# Altium project Nimb_ver_2_0.PrjPcb
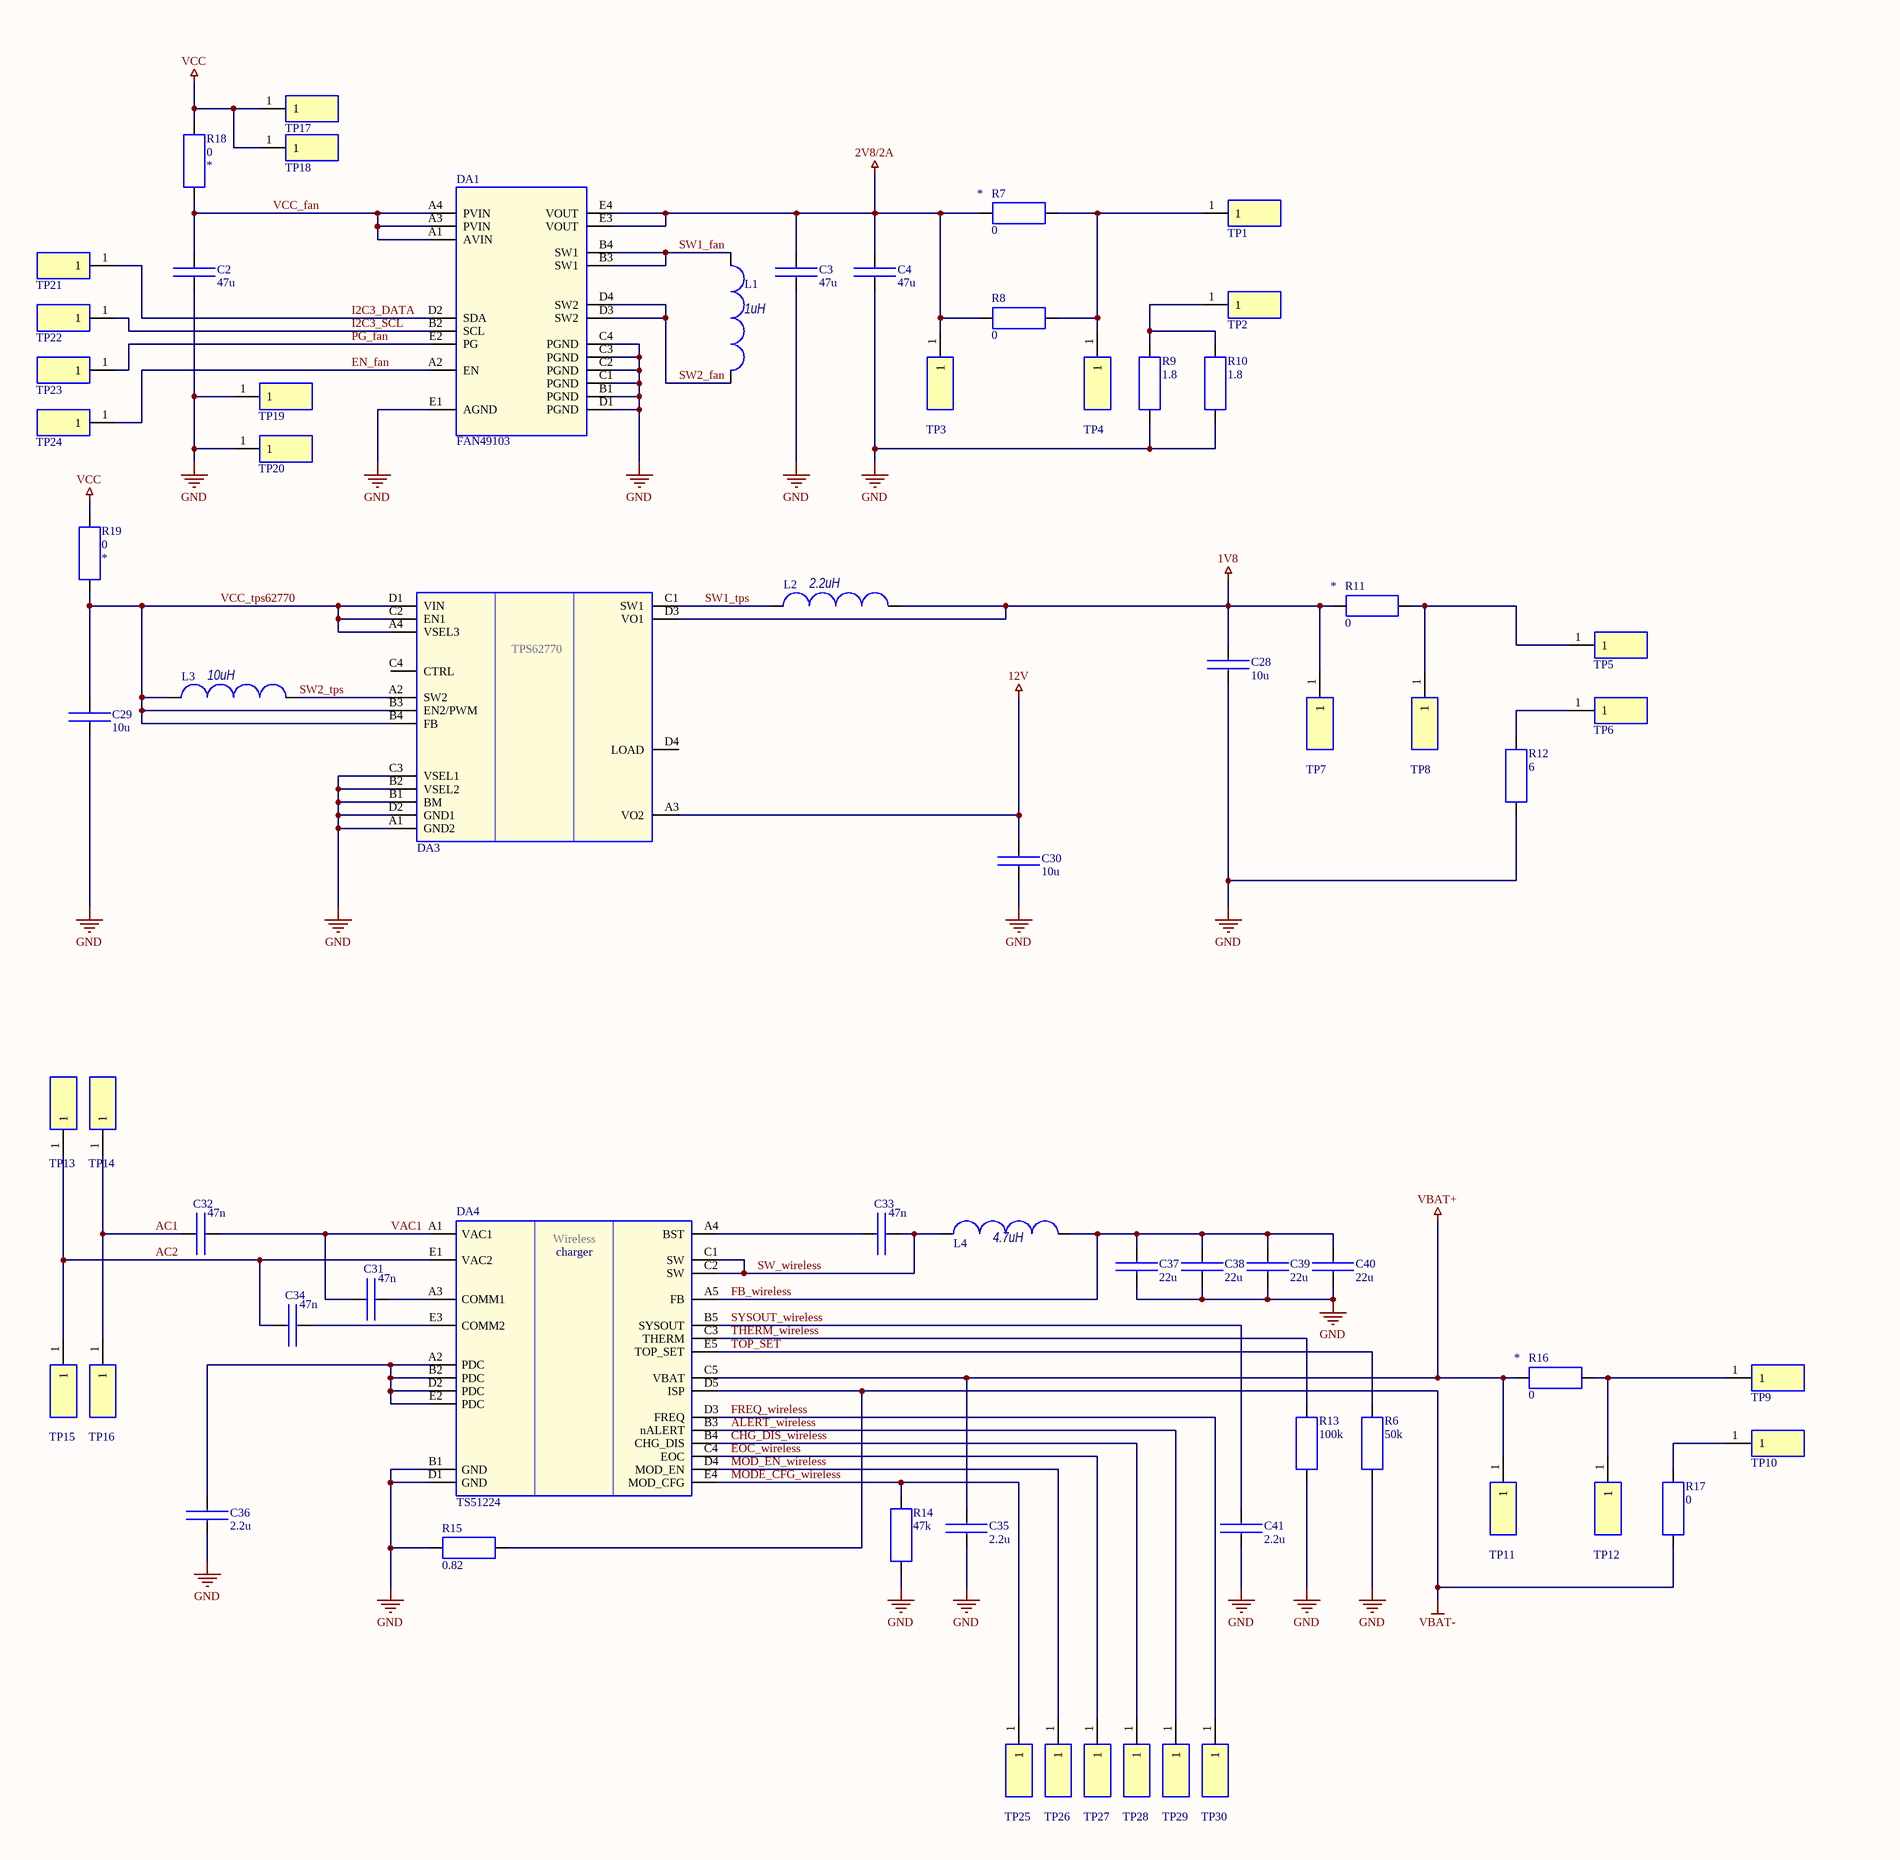
[diagram p0: Nimb_Ring_2_0.SchDoc, left]
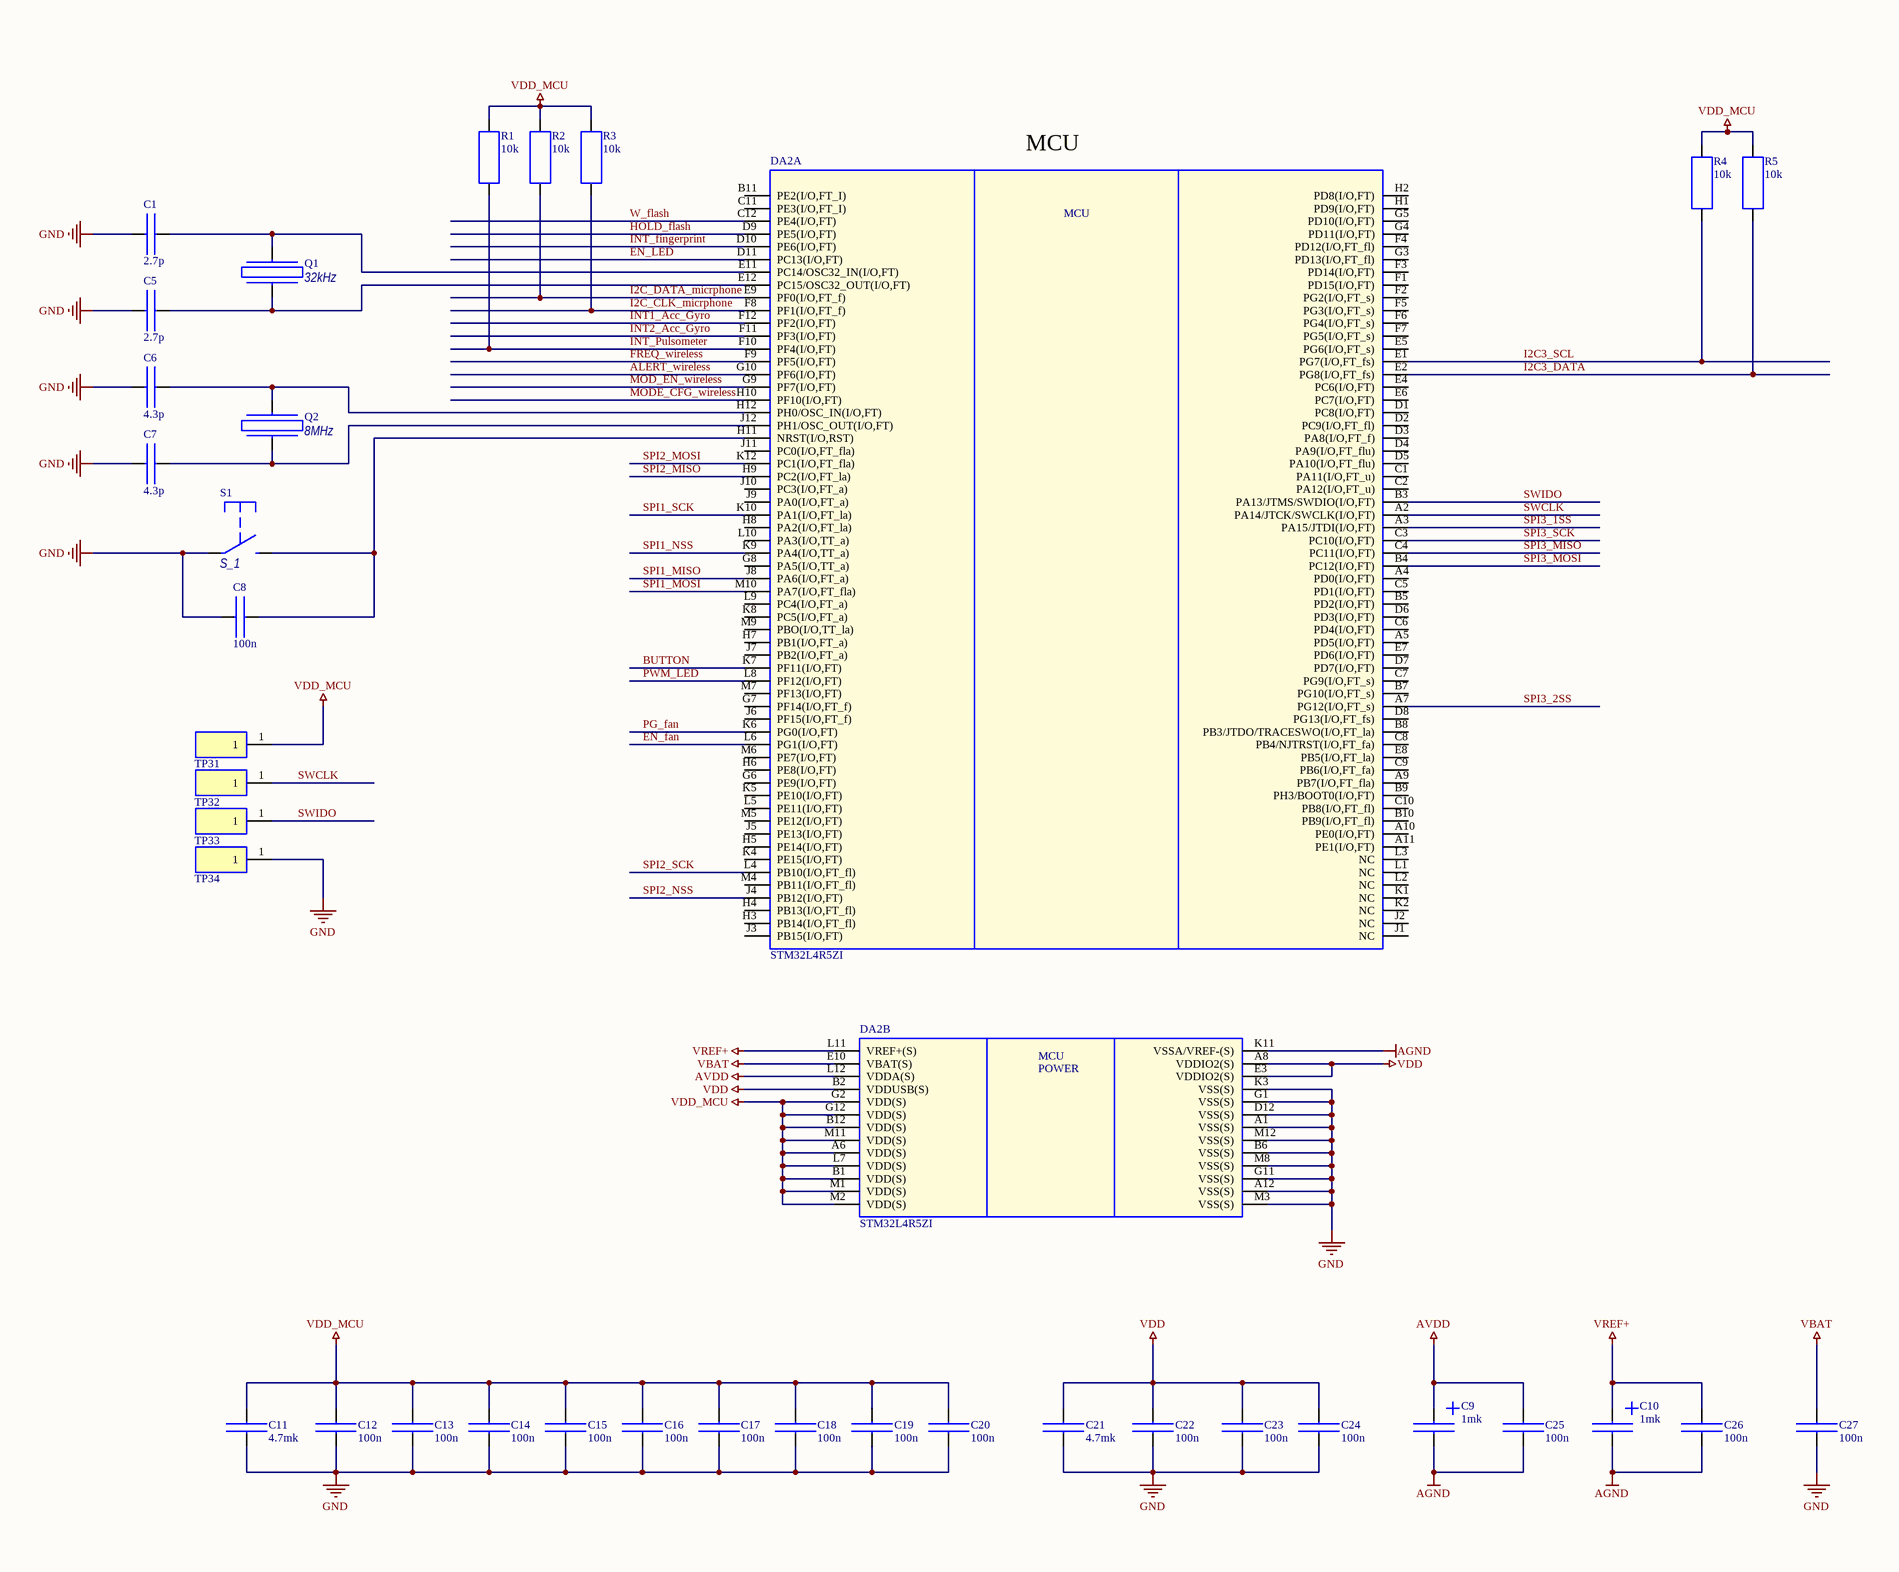
[diagram p1: Nimb_Ring_2_0.SchDoc, right]
1 sheet, 105 parts. Net scope: global (net labels, ports and power ports of the same name join across sheets).
Board file: Nimb_Ring_2_0.PcbDoc

## Sheet Nimb_Ring_2_0.SchDoc
size A1

### Parts
C1  2.7p  [CAP_0201]
C2  47u  [Cap0603]
C3  47u  [Cap0603]
C4  47u  [Cap0603]
C5  2.7p  [CAP_0201]
C6  4.3p  [CAP_0201]
C7  4.3p  [CAP_0201]
C8  100n  [CAP_0201]
C9  1mk  [CAP_0201]
C10  1mk  [CAP_0201]
C11  4.7mk  [CAP_0201]
C12  100n  [CAP_0201]
C13  100n  [CAP_0201]
C14  100n  [CAP_0201]
C15  100n  [CAP_0201]
C16  100n  [CAP_0201]
C17  100n  [CAP_0201]
C18  100n  [CAP_0201]
C19  100n  [CAP_0201]
C20  100n  [CAP_0201]
C21  4.7mk  [CAP_0201]
C22  100n  [CAP_0201]
C23  100n  [CAP_0201]
C24  100n  [CAP_0201]
C25  100n  [CAP_0201]
C26  100n  [CAP_0201]
C27  100n  [CAP_0201]
C28  10u  [Cap0402]
C29  10u  [Cap0402]
C30  10u  [Cap0402]
C31  47n  [Cap0402]
C32  47n  [Cap0402]
C33  47n  [Cap0402]
C34  47n  [Cap0402]
C35  2.2u  [Cap0603]
C36  2.2u  [Cap0402]
C37  22u  [Cap0603]
C38  22u  [Cap0603]
C39  22u  [Cap0603]
C40  22u  [Cap0603]
C41  2.2u  [Cap0603]
DA1  FAN49103  [WLCSP20]
DA2  STM32L4R5ZI  [WLCSP144]  (parts A,B of 2)
DA3  TPS62770  [DSBGA16]  (value not drawn)
DA4  TS51224  [BGA_25 (5x5 ARRAY)]
L1  1uH  [Ind_0806]
L2  2.2uH  [IND_0806(2016metric)]
L3  10uH  [IND_0806(2016metric)]
L4  4.7uH  [COIL-1008CS_V]
Q1  32kHz  [NX3215SA-32.768KHZ-EXS00A-MU00525]
Q2  8MHz  [NDK-NX3225GD-8MHZ-STD-CRA-3_V]
R1  10k  [RESC0402(1005)_L]
R2  10k  [RESC0402(1005)_L]
R3  10k  [RESC0402(1005)_L]
R4  10k  [RESC0402(1005)_L]
R5  10k  [RESC0402(1005)_L]
R6  50k  [RESC0402(1005)_L]
R7  0  [RES2512(6332M)]
R8  0  [RES6.5-3.4X1.9]
R9  1.8  [RES2512(6332M)]
R10  1.8  [RES6.5-3.4X1.9]
R11  0  [RES2512(6332M)]
R12  6  [RES2512(6332M)]
R13  100k  [RESC0402(1005)_L]
R14  47k  [RESC0402(1005)_L]
R15  0.82  [RES0603(1608M)]
R16  0  [RES2512(6332M)]
R17  0  [RES2512(6332M)]
R18  0  [RES2512(6332M)]
R19  0  [RES2512(6332M)]
S1  S_1  [BOUR-7914G-1-000E_V]
TP1  Test_Pad  [TEST_PAD_Button]  (value not drawn)
TP2  Test_Pad  [TEST_PAD_Button]  (value not drawn)
TP3  Test_Pad  [Test_Pad_PLS1]  (value not drawn)
TP4  Test_Pad  [Test_Pad_PLS1]  (value not drawn)
TP5  Test_Pad  [TEST_PAD_Button]  (value not drawn)
TP6  Test_Pad  [TEST_PAD_Button]  (value not drawn)
TP7  Test_Pad  [Test_Pad_PLS1]  (value not drawn)
TP8  Test_Pad  [Test_Pad_PLS1]  (value not drawn)
TP9  Test_Pad  [TEST_PAD_Button]  (value not drawn)
TP10  Test_Pad  [TEST_PAD_Button]  (value not drawn)
TP11  Test_Pad  [Test_Pad_PLS1]  (value not drawn)
TP12  Test_Pad  [Test_Pad_PLS1]  (value not drawn)
TP13  Test_Pad  [Test_Pad_PLS1]  (value not drawn)
TP14  Test_Pad  [Test_Pad_PLS1]  (value not drawn)
TP15  Test_Pad  [TEST_PAD_Button]  (value not drawn)
TP16  Test_Pad  [TEST_PAD_Button]  (value not drawn)
TP17  Test_Pad  [TEST_PAD_Button]  (value not drawn)
TP18  Test_Pad  [Test_Pad_PLS1]  (value not drawn)
TP19  Test_Pad  [TEST_PAD_Button]  (value not drawn)
TP20  Test_Pad  [Test_Pad_PLS1]  (value not drawn)
TP21  Test_Pad  [Test_Pad_PLS1]  (value not drawn)
TP22  Test_Pad  [Test_Pad_PLS1]  (value not drawn)
TP23  Test_Pad  [Test_Pad_PLS1]  (value not drawn)
TP24  Test_Pad  [Test_Pad_PLS1]  (value not drawn)
TP25  Test_Pad  [Test_Pad_PLS1]  (value not drawn)
TP26  Test_Pad  [Test_Pad_PLS1]  (value not drawn)
TP27  Test_Pad  [Test_Pad_PLS1]  (value not drawn)
TP28  Test_Pad  [Test_Pad_PLS1]  (value not drawn)
TP29  Test_Pad  [Test_Pad_PLS1]  (value not drawn)
TP30  Test_Pad  [Test_Pad_PLS1]  (value not drawn)
TP31  Test_Pad  [Test_Pad_PLS1]  (value not drawn)
TP32  Test_Pad  [Test_Pad_PLS1]  (value not drawn)
TP33  Test_Pad  [Test_Pad_PLS1]  (value not drawn)
TP34  Test_Pad  [Test_Pad_PLS1]  (value not drawn)

### Nets
1V8: C28.2 DA3.D3(VO1) L2.2 R11.2 TP7.1
2V8/2A: C3.2 C4.2 DA1.E3(VOUT) DA1.E4(VOUT) R7.2 R8.2 TP3.1
12V: C30.2 DA3.A3(VO2)
AGND: C9.2 C10.2 C25.1 C26.1 DA2.K11(VSSA/VREF-(S))
AVDD: C9.1 C25.2 DA2.L12(VDDA(S))
GND: C1.2 C2.1 C3.1 C4.1 C5.2 C6.2 C7.2 C8.2 C11.1 C12.1 C13.1 C14.1 C15.1 C16.1 C17.1 C18.1 C19.1 C20.1 C21.1 C22.1 C23.1 C24.1 C27.1 C28.1 C29.1 C30.1 C35.2 C36.2 C37.2 C38.2 C39.2 C40.2 C41.2 DA1.B1(PGND) DA1.C1(PGND) DA1.C2(PGND) DA1.C3(PGND) DA1.C4(PGND) DA1.D1(PGND) DA1.E1(AGND) DA2.A1(VSS(S)) DA2.A12(VSS(S)) DA2.B6(VSS(S)) DA2.D12(VSS(S)) DA2.G1(VSS(S)) DA2.G11(VSS(S)) DA2.K3(VSS(S)) DA2.M3(VSS(S)) DA2.M8(VSS(S)) DA2.M12(VSS(S)) DA3.A1(GND2) DA3.B1(BM) DA3.B2(VSEL2) DA3.C3(VSEL1) DA3.D2(GND1) DA4.B1(GND) DA4.D1(GND) R6.1 R9.2 R10.2 R12.2 R13.1 R14.1 R15.2 S1.1 TP19.1 TP20.1 TP34.1
VBAT: C27.2 DA2.E10(VBAT(S))
VBAT+: C35.1 DA4.C5(VBAT) R16.2 TP11.1
VBAT-: DA4.D5(ISP) R15.1 R17.2
VCC: R18.1 R19.1 TP17.1 TP18.1
VDD: C21.2 C22.2 C23.2 C24.2 DA2.A8(VDDIO2(S)) DA2.B2(VDDUSB(S)) DA2.E3(VDDIO2(S))
VDD_MCU: C11.2 C12.2 C13.2 C14.2 C15.2 C16.2 C17.2 C18.2 C19.2 C20.2 DA2.A6(VDD(S)) DA2.B1(VDD(S)) DA2.B12(VDD(S)) DA2.G2(VDD(S)) DA2.G12(VDD(S)) DA2.L7(VDD(S)) DA2.M1(VDD(S)) DA2.M2(VDD(S)) DA2.M11(VDD(S)) R1.2 R2.2 R3.2 R4.2 R5.2 TP31.1
VREF+: C10.1 C26.2 DA2.L11(VREF+(S))
AC1: C32.1 TP14.1 TP16.1
AC2: C34.1 DA4.E1(VAC2) TP13.1 TP15.1
ALERT_wireless: DA2.G10(PF6(I/O,FT)) DA4.B3(nALERT) TP29.1
BUTTON: DA2.K7(PF11(I/O,FT))
CHG_DIS_wireless: DA4.B4(CHG_DIS) TP28.1
EN_fan: DA1.A2(EN) DA2.L6(PG1(I/O,FT)) TP24.1
EN_LED: DA2.D11(PC13(I/O,FT))
EOC_wireless: DA4.C4(EOC) TP27.1
FB_wireless: C37.1 C38.1 C39.1 C40.1 DA4.A5(FB) L4.2
FREQ_wireless: DA2.F9(PF5(I/O,FT)) DA4.D3(FREQ) TP30.1
HOLD_flash: DA2.D9(PE5(I/O,FT))
I2C3_DATA: DA1.D2(SDA) DA2.E2(PG8(I/O,FT_fs)) R5.1 TP21.1
I2C3_SCL: DA1.B2(SCL) DA2.E1(PG7(I/O,FT_fs)) R4.1 TP22.1
I2C_CLK_micrphone: DA2.F8(PF1(I/O,FT_f)) R3.1
I2C_DATA_micrphone: DA2.E9(PF0(I/O,FT_f)) R2.1
INT1_Acc_Gyro: DA2.F12(PF2(I/O,FT))
INT2_Acc_Gyro: DA2.F11(PF3(I/O,FT))
INT_fingerprint: DA2.D10(PE6(I/O,FT))
INT_Pulsometer: DA2.F10(PF4(I/O,FT)) R1.1
MOD_EN_wireless: DA2.G9(PF7(I/O,FT)) DA4.D4(MOD_EN) TP26.1
MODE_CFG_wireless: DA2.H10(PF10(I/O,FT)) DA4.E4(MOD_CFG) R14.2 TP25.1
PG_fan: DA1.E2(PG) DA2.K6(PG0(I/O,FT)) TP23.1
PWM_LED: DA2.L8(PF12(I/O,FT))
SPI1_MISO: DA2.J8(PA6(I/O,FT_a))
SPI1_MOSI: DA2.M10(PA7(I/O,FT_fla))
SPI1_NSS: DA2.K9(PA4(I/O,TT_a))
SPI1_SCK: DA2.K10(PA1(I/O,FT_la))
SPI2_MISO: DA2.H9(PC2(I/O,FT_la))
SPI2_MOSI: DA2.K12(PC1(I/O,FT_fla))
SPI2_NSS: DA2.J4(PB12(I/O,FT))
SPI2_SCK: DA2.L4(PB10(I/O,FT_fl))
SPI3_1SS: DA2.A3(PA15/JTDI(I/O,FT))
SPI3_2SS: DA2.A7(PG12(I/O,FT_s))
SPI3_MISO: DA2.C4(PC11(I/O,FT))
SPI3_MOSI: DA2.B4(PC12(I/O,FT))
SPI3_SCK: DA2.C3(PC10(I/O,FT))
SW1_fan: DA1.B3(SW1) DA1.B4(SW1) L1.1
SW1_tps: DA3.C1(SW1) L2.1
SW2_fan: DA1.D3(SW2) DA1.D4(SW2) L1.2
SW2_tps: DA3.A2(SW2) L3.2
SW_wireless: C33.1 DA4.C1(SW) DA4.C2(SW) L4.1
SWCLK: DA2.A2(PA14/JTCK/SWCLK(I/O,FT)) TP32.1
SWIDO: DA2.B3(PA13/JTMS/SWDIO(I/O,FT)) TP33.1
SYSOUT_wireless: C41.1 DA4.B5(SYSOUT)
THERM_wireless: DA4.C3(THERM) R13.2
TOP_SET: DA4.E5(TOP_SET) R6.2
VAC1: C31.1 C32.2 DA4.A1(VAC1)
VCC_fan: C2.2 DA1.A1(AVIN) DA1.A3(PVIN) DA1.A4(PVIN) R18.2
VCC_tps62770: C29.2 DA3.A4(VSEL3) DA3.B3(EN2/PWM) DA3.B4(FB) DA3.C2(EN1) DA3.D1(VIN) L3.1 R19.2
W_flash: DA2.C12(PE4(I/O,FT))
NetC1_1: C1.1 DA2.E11(PC14/OSC32_IN(I/O,FT)) Q1.1
NetC5_1: C5.1 DA2.E12(PC15/OSC32_OUT(I/O,FT)) Q1.2
NetC6_1: C6.1 DA2.H12(PH0/OSC_IN(I/O,FT)) Q2.1
NetC7_1: C7.1 DA2.J12(PH1/OSC_OUT(I/O,FT)) Q2.2
NetC8_1: C8.1 DA2.H11(NRST(I/O,RST)) S1.2
NetC31_2: C31.2 DA4.A3(COMM1)
NetC33_2: C33.2 DA4.A4(BST)
NetC34_2: C34.2 DA4.E3(COMM2)
NetC36_1: C36.1 DA4.A2(PDC) DA4.B2(PDC) DA4.D2(PDC) DA4.E2(PDC)
NetR7_1: R7.1 R8.1 TP1.1 TP4.1
NetR9_1: R9.1 R10.1 TP2.1
NetR11_1: R11.1 TP5.1 TP8.1
NetR12_1: R12.1 TP6.1
NetR16_1: R16.1 TP9.1 TP12.1
NetR17_1: R17.1 TP10.1

Not connected (* = marked no-connect by the designer): DA2 A4(PD0(I/O,FT)) A5(PD5(I/O,FT)) A9(PB7(I/O,FT_fla)) A10(PE0(I/O,FT)) A11(PE1(I/O,FT)) B5(PD2(I/O,FT)) B7(PG10(I/O,FT_s)) B8(PB3/JTDO/TRACESWO(I/O,FT_la)) B9(PH3/BOOT0(I/O,FT)) B10(PB9(I/O,FT_fl)) B11(PE2(I/O,FT_I)) C1(PA11(I/O,FT_u)) C2(PA12(I/O,FT_u)) C5(PD1(I/O,FT)) C6(PD4(I/O,FT)) C7(PG9(I/O,FT_s)) C8(PB4/NJTRST(I/O,FT_fa)) C9(PB6(I/O,FT_fa)) C10(PB8(I/O,FT_fl)) C11(PE3(I/O,FT_I)) D1(PC8(I/O,FT)) D2(PC9(I/O,FT_fl)) D3(PA8(I/O,FT_f)) D4(PA9(I/O,FT_flu)) D5(PA10(I/O,FT_flu)) D6(PD3(I/O,FT)) D7(PD7(I/O,FT)) D8(PG13(I/O,FT_fs)) E4(PC6(I/O,FT)) E5(PG6(I/O,FT_s)) E6(PC7(I/O,FT)) E7(PD6(I/O,FT)) E8(PB5(I/O,FT_la)) F1(PD15(I/O,FT)) F2(PG2(I/O,FT_s)) F3(PD14(I/O,FT)) F4(PD12(I/O,FT_fl)) F5(PG3(I/O,FT_s)) F6(PG4(I/O,FT_s)) F7(PG5(I/O,FT_s)) G3(PD13(I/O,FT_fl)) G4(PD11(I/O,FT)) G5(PD10(I/O,FT)) G6(PE9(I/O,FT)) G7(PF14(I/O,FT_f)) G8(PA5(I/O,TT_a)) H1(PD9(I/O,FT)) H2(PD8(I/O,FT)) H3(PB14(I/O,FT_fl)) H4(PB13(I/O,FT_fl)) H5(PE14(I/O,FT)) H6(PE8(I/O,FT)) H7(PB1(I/O,FT_a)) H8(PA2(I/O,FT_la)) J1(NC) J2(NC) J3(PB15(I/O,FT)) J5(PE13(I/O,FT)) J6(PF15(I/O,FT_f)) J7(PB2(I/O,FT_a)) J9(PA0(I/O,FT_a)) J10(PC3(I/O,FT_a)) J11(PC0(I/O,FT_fla)) K1(NC) K2(NC) K4(PE15(I/O,FT)) K5(PE10(I/O,FT)) K8(PC5(I/O,FT_a)) L1(NC) L2(NC) L3(NC) L5(PE11(I/O,FT)) L9(PC4(I/O,FT_a)) L10(PA3(I/O,TT_a)) M4(PB11(I/O,FT_fl)) M5(PE12(I/O,FT)) M6(PE7(I/O,FT)) M7(PF13(I/O,FT)) M9(PBO(I/O,TT_la)); DA3 C4(CTRL) D4(LOAD)

### Notes on the sheet
- (near DA2) MCU
- (in symbol STM32L4R5ZI, part A) MCU
- (in symbol STM32L4R5ZI, part B) MCU; POWER
- (in symbol TS51224) Wireless; charger

### Library data of the parts
C1 C5-C8 C12-C20 C22-C27 = C: ManufacturerPartNumber: GRM155R71C104KA88; DataSheet: *; PartNumber: *; Power/Voltage: *; Tolerance: *; TU/GOST: *; Type: *; Package: *; TKE/TKC: *; Примечание: *; Supplier: *; BCPid: *; Name: *; Rem: *
  C1 C5: Value: 2.7p
  C6 C7: Value: 4.3p
  C8 C12-C20 C22-C27: Value: 100n
C2 = C: CAP CER 47UF 6.3V X5R 0603; ManufacturerPartNumber: GRM188R60J476ME15J; Manufacturer: Murata; Tolerance: 20%; Type: 0402; DataSheet: *; PartNumber: *; Power/Voltage: 6.3V; TU/GOST: *; Package: *; TKE/TKC: *; Примечание: *; Supplier: *; BCPid: *; Name: *; Rem: *; Value: 47u
C3 C4 = C: CAP CER 47UF 6.3V X5R 0603; ManufacturerPartNumber: GRM188R60J476ME15J; Manufacturer: Murata; Tolerance: 20%; Type: 0603; DataSheet: *; PartNumber: *; Power/Voltage: 6.3V; TU/GOST: *; Package: *; TKE/TKC: *; Примечание: *; Supplier: *; BCPid: *; Name: *; Rem: *; Value: 47u
C9 C10 = C_Polar: DataSheet: *; PartNumber: *; Power/Voltage: *; Tolerance: *; TU/GOST: *; Type: *; Package: *; TKE/TKC: *; Примечание: *; Supplier: *; BCPid: *; ManufacturerPartNumber: *; Name: *; Rem: *; Value: 1mk
C11 C21 = C: DataSheet: *; PartNumber: *; Power/Voltage: *; Tolerance: *; TU/GOST: *; Type: *; Package: *; TKE/TKC: *; Примечание: *; Supplier: *; BCPid: *; Name: *; Rem: *; Value: 4.7mk
C28-C30 = C: CAP CER 10UF 6.3V X5R 0402; ManufacturerPartNumber: GRM155R60J106ME44D; Manufacturer: MURATA; Tolerance: 20%; DataSheet: https://www.compel.ru/item-pdf/703bf2d700417c16d8c0e48aedab8cc2/ps/mur~grm.pdf; PartNumber: *; Power/Voltage: 6.3V; TU/GOST: *; Type: *; Package: 0402; TKE/TKC: *; Примечание: *; Supplier: https://www.compel.ru/infosheet/MUR/GRM155R60J106ME44D; BCPid: *; Name: *; Rem: *; Value: 10u
C31 C32 C34 = C: CAP CER 47nF 50V X5R 0402; ManufacturerPartNumber: GRM155R71H473KE14D; Manufacturer: MURATA; Tolerance: 10%; DataSheet: https://www.compel.ru/item-pdf/703bf2d700417c16d8c0e48aedab8cc2/ps/mur~grm.pdf; PartNumber: *; Power/Voltage: 50V; TU/GOST: *; Type: *; Package: 0402; TKE/TKC: *; Примечание: *; Supplier: https://www.compel.ru/infosheet/MUR/GRM155R71H473KE14D; BCPid: *; Name: *; Rem: *; Value: 47n
C33 = C: CAP CER 47nF 10V X5R 0402; ManufacturerPartNumber: GRM155R61A473KA01D; Manufacturer: MURATA; Tolerance: 10%; DataSheet: https://www.compel.ru/item-pdf/703bf2d700417c16d8c0e48aedab8cc2/ps/mur~grm.pdf; PartNumber: *; Power/Voltage: 10V; TU/GOST: *; Type: *; Package: 0402; TKE/TKC: *; Примечание: *; Supplier: https://www.compel.ru/infosheet/MUR/GRM155R61A473KA01D; BCPid: *; Name: *; Rem: *; Value: 47n
C35 C41 = C: CAP CER 2.2UF 10V X5R 0402; ManufacturerPartNumber: GRM155R61A225KE95D; Manufacturer: MURATA; Tolerance: 10%; DataSheet: https://www.compel.ru/item-pdf/703bf2d700417c16d8c0e48aedab8cc2/ps/mur~grm.pdf; PartNumber: *; Power/Voltage: 10V; TU/GOST: *; Type: *; Package: 0402; TKE/TKC: *; Примечание: *; Supplier: https://www.compel.ru/infosheet/MUR/GRM155R61A225KE95D; BCPid: *; Name: *; Rem: *; Value: 2.2u
C36 = C: CAP CER 2.2UF 25V X5R 0402; ManufacturerPartNumber: GRM155R61E225KE11D; Manufacturer: MURATA; Tolerance: 10%; DataSheet: https://www.compel.ru/item-pdf/703bf2d700417c16d8c0e48aedab8cc2/ps/mur~grm.pdf; PartNumber: *; Power/Voltage: 25V; TU/GOST: *; Type: *; Package: 0402; TKE/TKC: *; Примечание: *; Supplier: https://www.compel.ru/infosheet/MUR/GRM155R61E225KE11D; BCPid: *; Name: *; Rem: *; Value: 2.2u
C37-C40 = C: CAP CER 22UF 10V X5R 0603; ManufacturerPartNumber: ZRB18AR61A226ME01L; Manufacturer: MURATA; Tolerance: 15%; DataSheet: https://ru.mouser.com/datasheet/2/281/product-1108674.pdf; PartNumber: *; Power/Voltage: 10V; TU/GOST: *; Type: *; Package: 0603(1608metric); TKE/TKC: *; Примечание: *; Supplier: https://ru.mouser.com/ProductDetail/Murata-Electronics/ZRB18AR61A226ME01L?qs=sGAEpiMZZMs0AnBnWHyRQN7%2fAA2D2lPPknK%252bZ26wfT%2fc2YZrPwOUrA%3d%3d; BCPid: *; Name: *; Rem: *; Value: 22u
DA1 = FAN49103: I2C Buck-Boost Regulator 2.5A; Manufacturer: ON Semiconductor; ManufacturerPartNumber: FAN49103
DA3 = TPS62770: Multi-Rail DC/DC Converter; Manufacturer: Texas Instruments; ManufacturerPartNumber: TPS62770
DA4 = TS51224: IC RCVR CTLR WIRELESS 20-WLCSP; Manufacturer: SEMTECH; Datasheet: https://ru.mouser.com/pdfdocs/ts51224_datasheet-1276106.pdf; Supplier: *; ManufacturerPartNumber: TS51224
L1 = L: FIXED IND 1UH 3.4A 0.048OHM; ManufacturerPartNumber: DFE201612E1R0M; Manufacturer: Murata; Tolerance: 20%; Type: 0806; DataSheet: *; PartNumber: *; Power/Voltage: 3.4A; TU/GOST: *; Package: *; TKE/TKC: *; Примечание: *; Supplier: *; BCPid: *; Name: *; Rem: *; Value: 1uH
L2 = L: FIXED IND 2.2UH 1.2A 204mOHM; ManufacturerPartNumber: 1285AS-H-2R2M=P2; Manufacturer: MURATA; Tolerance: 20%; DataSheet: https://ru.mouser.com/datasheet/2/281/product-1023242.pdf; PartNumber: *; Power/Voltage: 1.2A; TU/GOST: *; Type: *; Package: 0806(2016metric); TKE/TKC: *; Примечание: *; Supplier: https://www.compel.ru/infosheet/MUR/1285AS-H-2R2M%3DP2; BCPid: *; Name: *; Rem: *; Value: 2.2uH
L3 = L: FIXED IND 10UH 225mA 1.2OHM; ManufacturerPartNumber: LQH2MCN100K02L; Manufacturer: MURATA; Tolerance: 10%; DataSheet: https://www.compel.ru/item-pdf/76de7fb58d43fc1b170a27bea408750b/pf/mur~lq.pdf; PartNumber: *; Power/Voltage: 225mA; TU/GOST: *; Type: *; Package: 0806(2016metric); TKE/TKC: *; Примечание: *; Supplier: https://www.compel.ru/infosheet/MUR/LQH2MCN100K02L; BCPid: *; Name: *; Rem: *; Value: 10uH
L4 = L: IND SMD 1008 4.7UH 1A 0.11OHM; ManufacturerPartNumber: CVH252009-4R7M; Manufacturer: Bourns; Tolerance: 20%; DataSheet: https://www.compel.ru/item-pdf/fd3d436d9fb9cbb3cd94496c14e882b0/ps/bourns~cvh252009.pdf; PartNumber: *; Power/Voltage: 1A; TU/GOST: *; Type: *; Package: *; TKE/TKC: *; Примечание: *; Supplier: *; BCPid: *; Name: *; Rem: *; Value: 4.7uH
Q1 Q2 = Q_1
  Q1: Value: 32kHz
  Q2: Value: 8MHz
R1-R5 R17 = R: DataSheet: *; PartNumber: *; Power/Voltage: *; Tolerance: *; TU/GOST: *; Type: *; Package: *; TKE/TKC: *; Примечание: *; Supplier: *; BCPid: *; ManufacturerPartNumber: *; Name: *; Rem: *
  R1-R5: Value: 10k
  R17: Value: 0
R6 = R: RES SMD 49.9kOHM 1% 62.5mW 0402; ManufacturerPartNumber: RC0402FR-0749K9L; Manufacturer: Yageo; DataSheet: https://www.compel.ru/item-pdf/01745689dfc7640c8aba99ada61670c4/pn/yag~res-0402-43k-1-.pdf; PartNumber: *; Power/Voltage: 62.5mW; Tolerance: 1%; TU/GOST: *; Type: *; Package: 0402; TKE/TKC: *; Примечание: *; Supplier: https://www.compel.ru/infosheet/YAG/RC0402FR-0749K9L; BCPid: *; Name: *; Rem: *; Value: 50k
R7 R11 R16 R18 R19 = R: RES SMD 0 OHM 5% 1W 2512; ManufacturerPartNumber: CR2512-J/-000ELF; Manufacturer: Bourns; TKE/TKC: 200ppm/C; DataSheet: https://www.compel.ru/item-pdf/2973128a4d6e6fdc81c175f1f47afa18/ps/bourns~cr2512.pdf; PartNumber: *; Power/Voltage: 1W; Tolerance: 5%; TU/GOST: *; Type: *; Package: 2512; Примечание: *; Supplier: https://www.compel.ru/infosheet/BOURNS/CR2512-J%2F-000ELF; BCPid: *; Name: *; Rem: *; Value: 0
R8 R10 = R: Axial; DataSheet: *; PartNumber: *; Power/Voltage: *; Tolerance: *; TU/GOST: *; Type: *; Package: AXIAL; TKE/TKC: *; Примечание: *; Supplier: *; BCPid: *; ManufacturerPartNumber: *; Name: *; Rem: *
  R8: Value: 0
  R10: Value: 1.8
R9 = R: RES SMD 1.8OHM 5% 2W 2512; ManufacturerPartNumber: CRM2512-JW-1R8ELF; Manufacturer: Bourns; DataSheet: *; PartNumber: *; Power/Voltage: 2W; Tolerance: *; TU/GOST: *; Type: *; Package: *; TKE/TKC: *; Примечание: *; Supplier: *; BCPid: *; Name: *; Rem: *; Value: 1.8
R12 = R: RES SMD 6OHM 5% 1W 2512; ManufacturerPartNumber: RC2512FK-076R04L; Manufacturer: Yageo; Tolerance: 1%; DataSheet: *; PartNumber: *; Power/Voltage: 1W; TU/GOST: *; Type: *; Package: *; TKE/TKC: *; Примечание: *; Supplier: *; BCPid: *; Name: *; Rem: *; Value: 6
R13 = R: RES SMD 100kOHM 5% 62.5mW 0402; ManufacturerPartNumber: RC0402JR-07100KL; Manufacturer: Yageo; Power/Voltage: 62.5; DataSheet: https://www.compel.ru/item-pdf/01745689dfc7640c8aba99ada61670c4/pn/yag~res-0402-43k-1-.pdf; PartNumber: *; Tolerance: 5%; TU/GOST: *; Type: *; Package: *; TKE/TKC: *; Примечание: *; Supplier: https://www.compel.ru/infosheet/YAG/RC0402JR-07100KL; BCPid: *; Name: *; Rem: *; Value: 100k
R14 = R: RES SMD 47kOHM 5% 62.5mW 0402; ManufacturerPartNumber: RC0402JR-0747KL; Manufacturer: Yageo; DataSheet: https://www.compel.ru/item-pdf/01745689dfc7640c8aba99ada61670c4/pn/yag~res-0402-43k-1-.pdf; PartNumber: *; Power/Voltage: 62.5mW; Tolerance: 5%; TU/GOST: *; Type: *; Package: *; TKE/TKC: *; Примечание: *; Supplier: https://www.compel.ru/infosheet/YAG/RC0402JR-0747KL; BCPid: *; Name: *; Rem: *; Value: 47k
R15 = R: RES SMD 0OHM 5% 1A 0603; ManufacturerPartNumber: CRCW0603R820FSEABL; Manufacturer: Vishay; DataSheet: https://www.compel.ru/item-pdf/51ca2eac34807276c9c515cf86bc2b62/ps/vishay~crcw.pdf; PartNumber: *; Power/Voltage: 1A; Tolerance: 5%; TU/GOST: *; Type: *; Package: *; TKE/TKC: *; Примечание: *; Supplier: *; BCPid: *; Name: *; Rem: *; Value: 0.82